# Altium project Retain_MedSprint26.PrjPcb
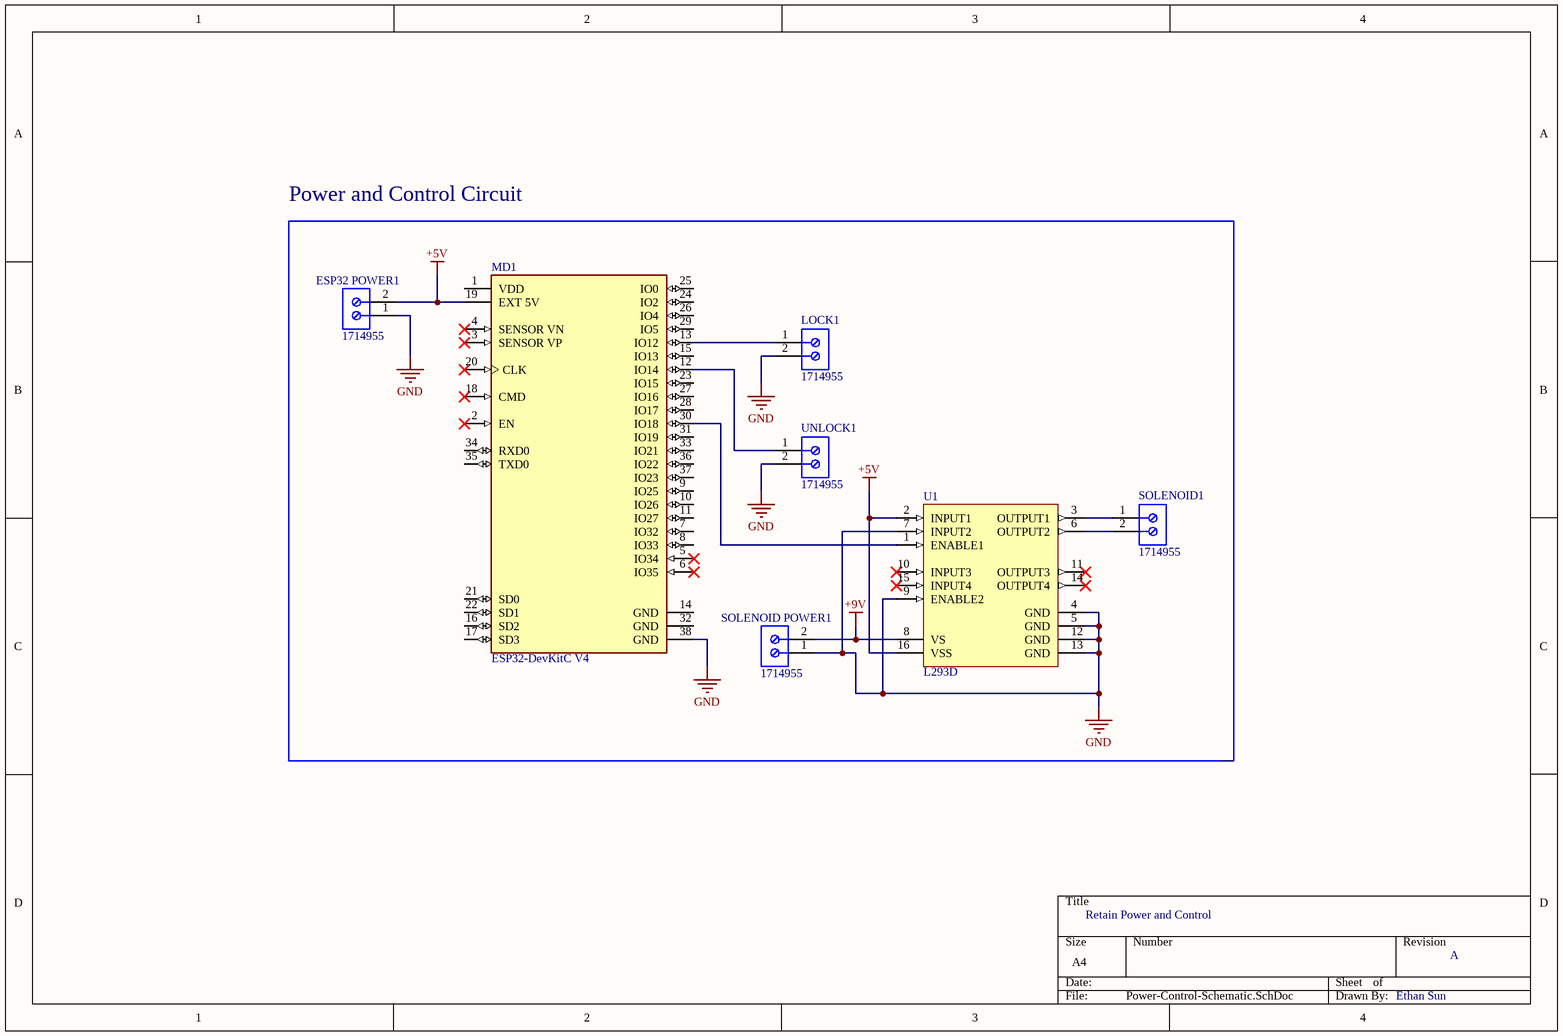
[diagram p0: Power-Control-Schematic.SchDoc]
1 sheet, 7 parts. Net scope: global (net labels, ports and power ports of the same name join across sheets).
Board file: Retain-PCB.PcbDoc

## Sheet Power-Control-Schematic.SchDoc
size A4; SheetNumber: 1; SheetTotal: 1

### Parts
ESP32_POWER1  1714955  [PHOE-1714955_V]
LOCK1  1714955  [PHOE-1714955_V]
MD1  ESP32-DevKitC V4  [FP-ESP32-DevKitC_V4-MFG]
SOLENOID1  1714955  [PHOE-1714955_V]
SOLENOID_POWER1  1714955  [PHOE-1714955_V]
U1  L293D  [STM-L293D-16]
UNLOCK1  1714955  [PHOE-1714955_V]

### Nets
+5V: ESP32_POWER1.2 MD1.19(EXT_5V) U1.2(INPUT1) U1.16(VSS)
+9V: SOLENOID_POWER1.2 U1.8(VS)
GND: ESP32_POWER1.1 LOCK1.2 MD1.38(GND) SOLENOID_POWER1.1 U1.4(GND) U1.5(GND) U1.7(INPUT2) U1.9(ENABLE2) U1.12(GND) U1.13(GND) UNLOCK1.2
NetLOCK1_1: LOCK1.1 MD1.13(IO12)
NetMD1_12: MD1.12(IO14) UNLOCK1.1
NetMD1_30: MD1.30(IO18) U1.1(ENABLE1)
NetSOLENOID1_1: SOLENOID1.1 U1.3(OUTPUT1)
NetSOLENOID1_2: SOLENOID1.2 U1.6(OUTPUT2)

Not connected (* = marked no-connect by the designer): MD1 1(VDD) 2(EN)* 3(SENSOR_VP)* 4(SENSOR_VN)* 5(IO34)* 6(IO35)* 7(IO32) 8(IO33) 9(IO25) 10(IO26) 11(IO27) 14(GND) 15(IO13) 16(SD2) 17(SD3) 18(CMD)* 20(CLK)* 21(SD0) 22(SD1) 23(IO15) 24(IO2) 25(IO0) 26(IO4) 27(IO16) 28(IO17) 29(IO5) 31(IO19) 32(GND) 33(IO21) 34(RXD0) 35(TXD0) 36(IO22) 37(IO23); U1 10(INPUT3)* 11(OUTPUT3)* 14(OUTPUT4)* 15(INPUT4)*

### Notes on the sheet
- Power and Control Circuit
- Retain Power and Control
- A
- Ethan Sun

### Library data of the parts
ESP32_POWER1 LOCK1 SOLENOID1 SOLENOID_POWER1 UNLOCK1 = CMP-2000-05797-1: PC Terminal Block, Pitch 6.35 mm, 1 x 2 Position, Height 21.5 mm, Tail Lenght 5.1 mm, RoHS, Bulk; Manufacturer: Phoenix Contact; Package Description: PC Terminal Block, Pitch 6.35 mm, 1 x 2 Position, Height 21.5 mm, Tail Lenght 5.1 mm; Datasheet URL: http://media.digikey.com/pdf/Data%20Sheets/Phoenix%20Contact%20PDFs/1714955.pdf; Package Reference: 1714955; Manufacturer URL: http://www.phoenixcontact.com/; Datasheet Version: 02/2010; Mounting Technology: ThroughHole
MD1 = CMP-194065-000004-1: WiFi Development Tools (802.11) ESP32 General Development Kit, ESP32-WROOM-32 on the board; Manufacturer: Espressif; Number Of Adc Channels: 16; Max Supply Voltage: 5V; Bandwidth: 2.4-2.5GHz; Interface: I2C,SPI,UART,I2S; Max Frequency: 2.5GHz; Min Supply Voltage: 2.7V; Number Of Gpio: 22; Package: ESP32-DevKitC V4; Device Class L2: RF Semiconductors and Devices; Device Class L3: Transceivers; ComponentLink2Description: Datasheet; Temperature Range Low: -40°C; ComponentLink2URL: https://docs.espressif.com/projects/esp-idf/en/latest/get-started/get-started-devkitc.html; RoHS: TRUE; Category: UNK; Automotive: No; Device Class L1: Integrated Circuits (ICs); Manufacturer Part Number: ESP32-DevKitC V4; Octopart: https://octopart.com/esp32-devkitc+v4-espressif+systems-107467262; Lead Free: Yes; Temperature: -40°C to
U1 = CMP-2000-06524-1: Push-Pull Four Channel Driver with Diode, 4.5 to 36 V, -40 to 150 degC, 16-Pin PDIP, RoHS, Tube; Manufacturer: STMicroelectronics; Number of Outputs: 4; Current - Peak Output: 1.2A; Current - Output / Channel: 600mA; Input Type: Non-Inverting; Other Related Documents: L293DViewAllSpecifications; Dynamic Catalog: HalfBridge; Voltage - Supply: 4.5V~36V; Other Names: 497-2936-5; Package / Case: 16-DIP(0.300",7.62mm); PartNumber: L293D; Operating Temperature: -40°C~150°C; Datasheet URL: http://www.st.com/st-web-ui/static/active/en/resource/technical/document/datasheet/CD00000059.pdf; Supplier Device Package: 16-PowerDIP; Packaging: Tube; Package Description: 16-Pin Thru-Hole Dual-In-Line, Body 20 x 6.85 mm, Pitch 2.54 mm; Standard Package: 25; Datasheet Version: 07/2003; On-State Resistance: -; Manufacturer URL: http://www.st.com/; Category: IntegratedCircuits(ICs); Family: PMIC-MOSFET,BridgeDrivers-InternalSwitch; Type: HalfBridge; Series: -; Mounting Technology: ThroughHole; Package Reference: DIP-16; Mounting Type: ThroughHole